# Altium schematic sheet ui_ext_conn.SchDoc: mcHF Pro Transceiver UI board
size A3; Author: Krassi Atanassov; CompanyName: MØNKA; Engineer: For radio amateurs experimentation, non-commercial use only. Thank you!; Revision: 0.8.5; SheetTotal: 13
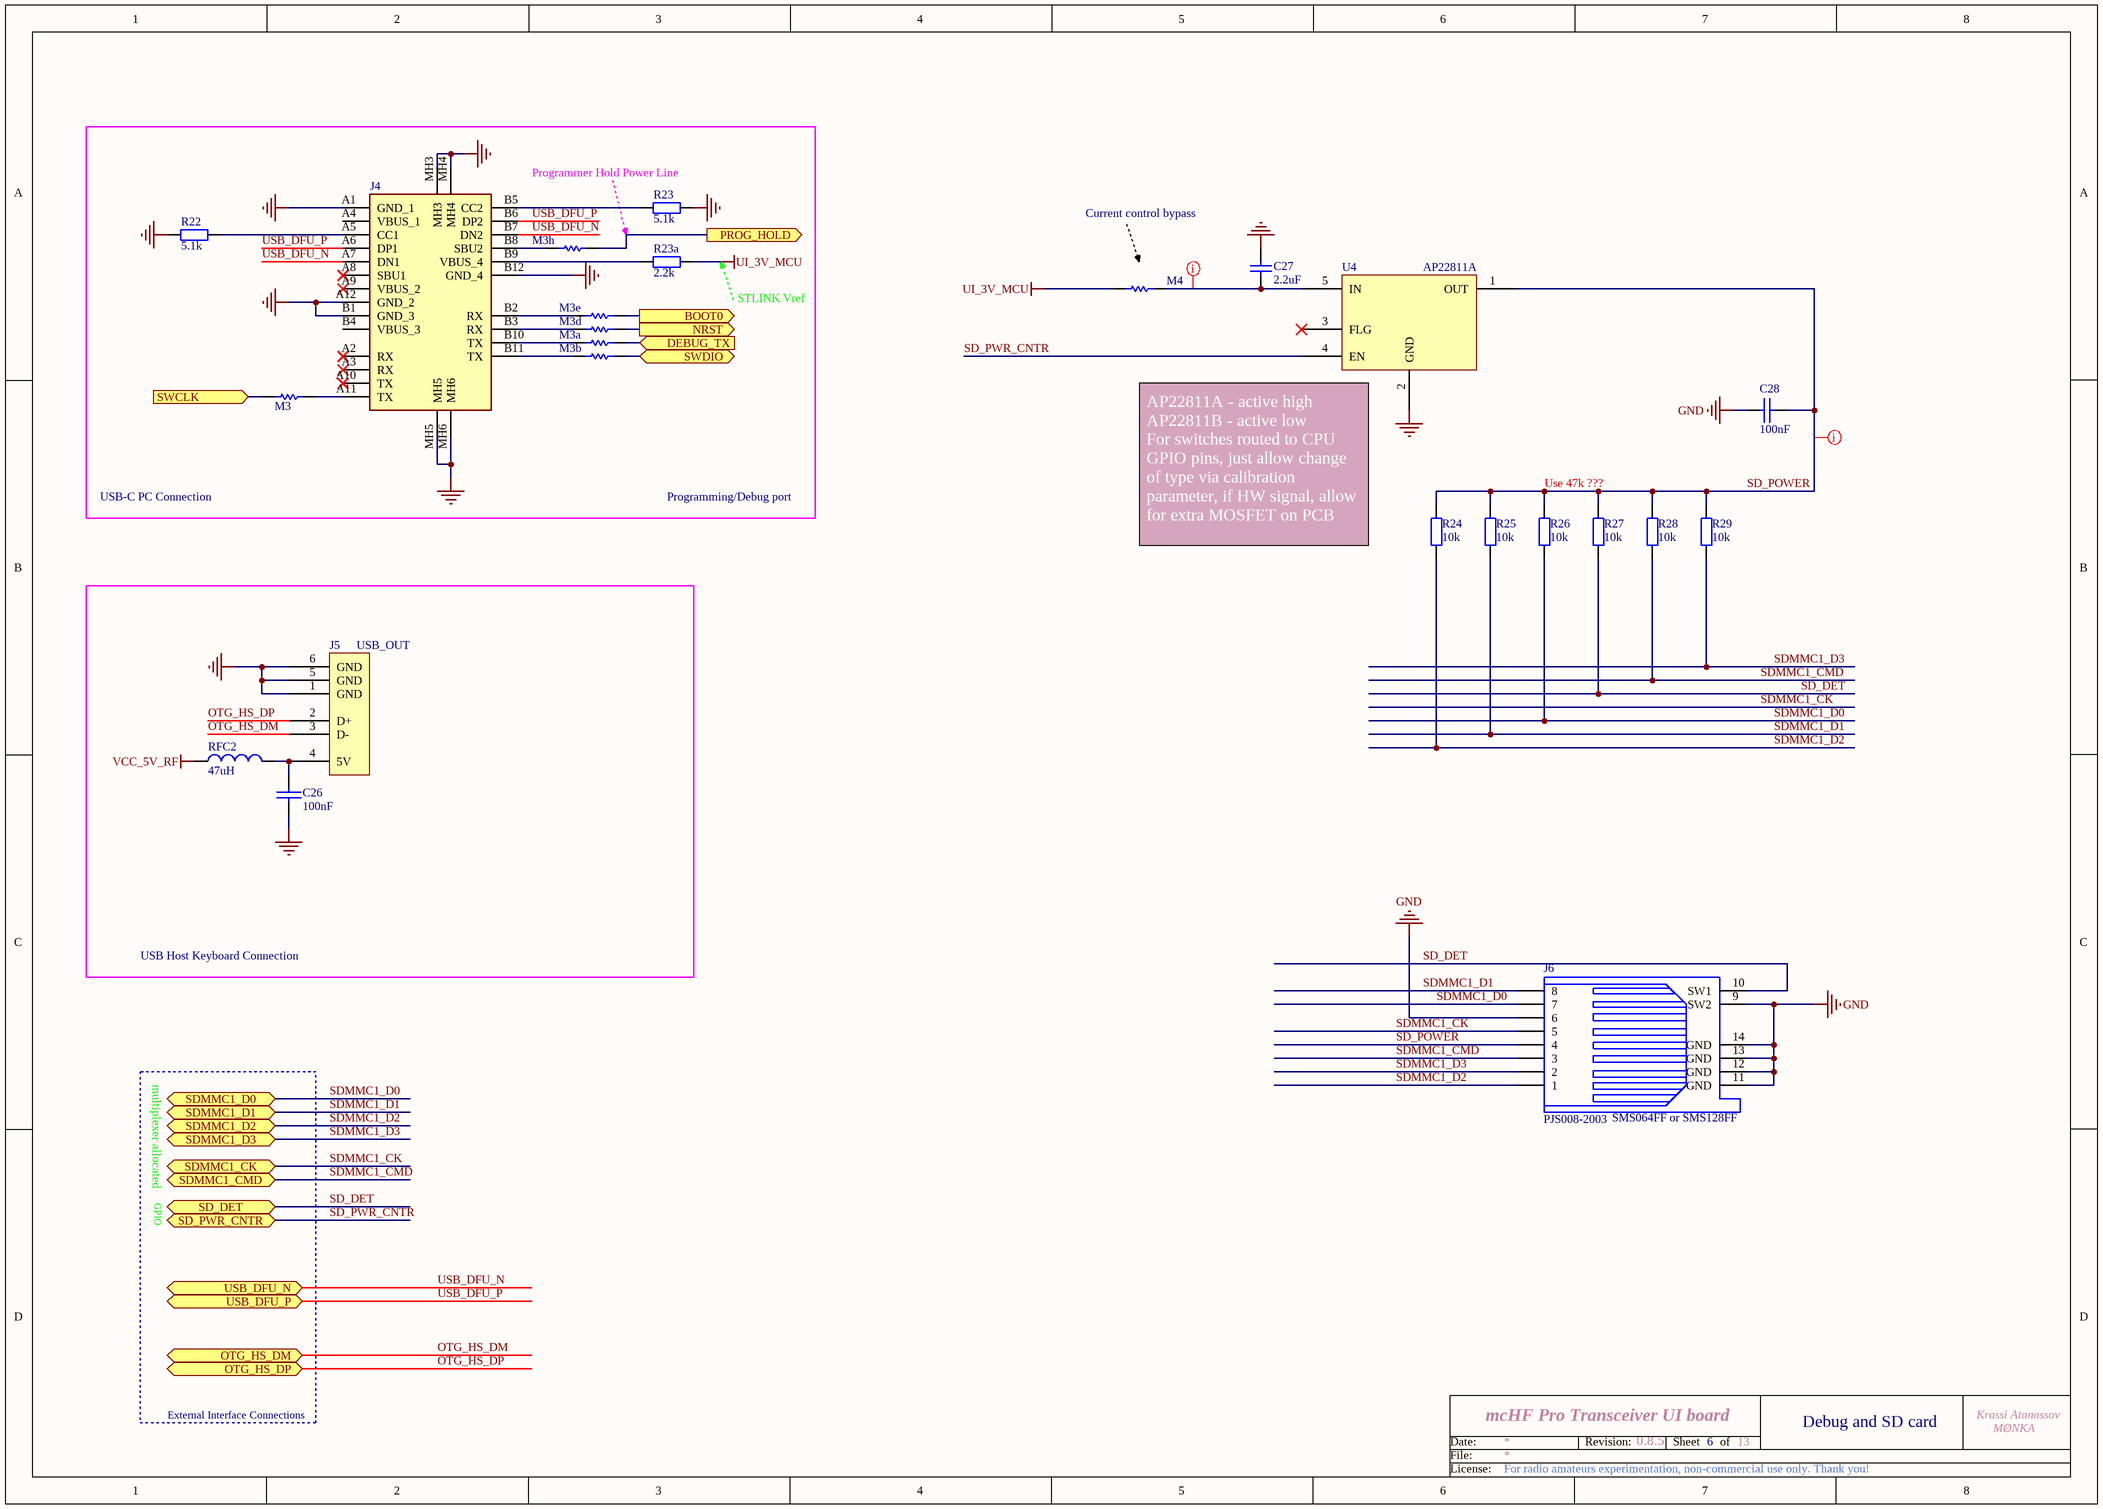
[diagram p0: ui_ext_conn.SchDoc]

## Parts
C26  100nF  [0805]
C27  2.2uF  [0805]
C28  100nF  [0805]
J4  219320-0001  [usbc_24p]  (value not drawn)
J5  USB_OUT  [USB_OUT_A]
J6  PJS008-2003  [PJS008-2003-1]
M3  0  [SB_0603_NO]  (value not drawn)  (net tie, no BOM)
M3a  0  [SB_0603_NO]  (value not drawn)  (net tie, no BOM)
M3b  0  [SB_0603_NO]  (value not drawn)  (net tie, no BOM)
M3d  0  [SB_0603_NO]  (value not drawn)  (net tie, no BOM)
M3e  0  [SB_0603_NO]  (value not drawn)  (net tie, no BOM)
M3h  0  [SB_0603_NO]  (value not drawn)  (net tie, no BOM)
M4  0  [SB_0603]  (value not drawn)  (net tie, no BOM)
R22  5.1k  [0805]
R23  5.1k  [0805]
R23a  2.2k  [0805]
R24  10k  [0805]
R25  10k  [0805]
R26  10k  [0805]
R27  10k  [0805]
R28  10k  [0805]
R29  10k  [0805]
RFC2  47uH  [0805]
U4  AP22811A  [SOT25-5]

## Blocks framed on the sheet
USB Host Keyboard Connection: C26 J5 RFC2

## Ports
BOOT0 (out), DEBUG_TX (in), NRST (out), OTG_HS_DM (bidir), OTG_HS_DP (bidir), PROG_HOLD (out), SD_DET (bidir), SD_PWR_CNTR (bidir), SDMMC1_CK (bidir), SDMMC1_CMD (bidir), SDMMC1_D0 (bidir), SDMMC1_D1 (bidir), SDMMC1_D2 (bidir), SDMMC1_D3 (bidir), SWCLK (in), SWDIO (bidir), USB_DFU_N (bidir), USB_DFU_P (bidir)

## Nets
GND: C26.1 C27.1 C28.2 J4.A1(GND_1) J4.A12(GND_2) J4.B1(GND_3) J4.B12(GND_4) J4.MH3 J4.MH4 J4.MH5 J4.MH6 J5.1(GND) J5.5(GND) J5.6(GND) J6.6 J6.9(SW2) J6.11(GND) J6.12(GND) J6.13(GND) J6.14(GND) R22.1 R23.2 U4.2(GND)
UI_3V_MCU: M4.1 R23a.2
VCC_5V_RF: RFC2.1
BOOT0: M3e.1 ; port BOOT0
DEBUG_TX: M3a.2 ; port DEBUG_TX
NRST: M3d.2 ; port NRST
OTG_HS_DM: J5.3(D-) ; port OTG_HS_DM
OTG_HS_DP: J5.2(D+) ; port OTG_HS_DP
PROG_HOLD: M3h.1 ; port PROG_HOLD
SD_DET: J6.10(SW1) R27.2 ; port SD_DET
SD_POWER: C28.1 J6.4 R24.1 R25.1 R26.1 R27.1 R28.1 R29.1 U4.1(OUT)
SD_PWR_CNTR: U4.4(EN) ; port SD_PWR_CNTR
SDMMC1_CK: J6.5 ; port SDMMC1_CK
SDMMC1_CMD: J6.3 R28.2 ; port SDMMC1_CMD
SDMMC1_D0: J6.7 R26.2 ; port SDMMC1_D0
SDMMC1_D1: J6.8 R25.2 ; port SDMMC1_D1
SDMMC1_D2: J6.1 R24.2 ; port SDMMC1_D2
SDMMC1_D3: J6.2 R29.2 ; port SDMMC1_D3
SWCLK: M3.2 ; port SWCLK
SWDIO: M3b.2 ; port SWDIO
USB_DFU_N: J4.A7(DN1) J4.B7(DN2) ; port USB_DFU_N
USB_DFU_P: J4.A6(DP1) J4.B6(DP2) ; port USB_DFU_P
NetC26_2: C26.2 J5.4(5V) RFC2.2
NetC27_2: C27.2 M4.2 U4.5(IN)
NetJ4_A5: J4.A5(CC1) R22.2
NetJ4_A11: J4.A11(TX) M3.1
NetJ4_B2: J4.B2(RX) M3e.2
NetJ4_B3: J4.B3(RX) M3d.1
NetJ4_B5: J4.B5(CC2) R23.1
NetJ4_B8: J4.B8(SBU2) M3h.2
NetJ4_B9: J4.B9(VBUS_4) R23a.1
NetJ4_B10: J4.B10(TX) M3a.1
NetJ4_B11: J4.B11(TX) M3b.1

Not connected (* = marked no-connect by the designer): J4 A2(RX)* A3(RX)* A4(VBUS_1) A8(SBU1)* A9(VBUS_2)* A10(TX)* B4(VBUS_3); U4 3(FLG)*

## Layout directives
rule Width Constraint [Pref Width = 12mil    Min Width = 12mil    Max Width = 12mil]: NetC27_2, SD_POWER

## Notes on the sheet
- Programmer Hold Power Line
- Current control bypass
- STLINK Vref
- USB-C PC Connection
- Programming/Debug port
- Use 47k ???
- (near U4) AP22811A - active high                                 AP22811B - active low                             For switches routed to CPU GPIO pins, just allow change of type via calibration parameter, if HW signal, allow for extra MOSFET on PCB
- multiplexer allocated
- (near J6) SMS064FF or SMS128FF
- GPIO
- External Interface Connections
- 6
- Debug and SD card
- Date:
- File:
- Revision:
- Sheet
- of
- License:

## Library data of the parts
C26 = CAP: Capacitor; Order: FN 174-0673; QT Order: QCC-00154; Price: 0.068
C27 = CAP SMD 0603  X5R 1礔 25V 10%: 0603  X5R 1礔; Rated voltage: 25V; Tolerance: 10%; Manufacturer: *; Manufacturer P/N: *; Order code Farnell: 1288202RL; Value: 1礔; Power: *; Technology: X5R; Temperature  Factor: *; Temperature Max: +125癈; Temperature Min: -55癈; STS Code: *
C28 = CAP: Capacitor; Order: FN 282-1264; QT Order: QCC-00157; Price: 0.089
J4 = usbc_24p: Universal Serial Bus (USB) Shielded I/O Receptacle, Type C, Vertical, Surface Mount, Height 8.8mm, 16 Circuits, Gold (Au) Flash Plating; Manufacturer_Name: Molex; Geometry.Height: 9.05mm; Mouser Part Number: 538-219320-0001; Mouser Price/Stock: https://www.mouser.co.uk/ProductDetail/Molex/219320-0001?qs=rQFj71Wb1eXha8qVBIXu3A%3D%3D; Manufacturer_Part_Number: 219320-0001; Datasheet Link: https://www.molex.com/content/dam/molex/molex-dot-com/products/automated/en-us/salesdrawingpdf/219/219320/2193200001_sd.pdf?inline
J5 = USB_OUT: USB Host Connector
J6 = microSD-PJS008-2003: Memory Card Connectors MicroSD Card Conn Revrs Mnt Push-Push; Manuf_1: YAMAICHI; Manuf_Part_1: PJS008-2003-1; Distrib: *; Order: PJS008-2003-1; ECCN_US/EU: n/a
M3 M3a M3b M3d M3e M3h M4 = Link: Value: 1K; Published: 8-Jun-2000; Revision: July-2002: Re-released for DXP Platform.; Publisher: Altium Limited
R22 R23 R23a R24 = RES: Resistor; Order: FN 146-9857; QT Order: QCR-00349; QT Price: 0.03; Price: 0.046
R25-R29 = RES: Resistor; Order: FN 146-9857; Price: 0.046
RFC2 = Inductor: Order: FN 166-9895; Price: 0.16
U4 = AP22811: High-side switch; Order: FN 274-8550